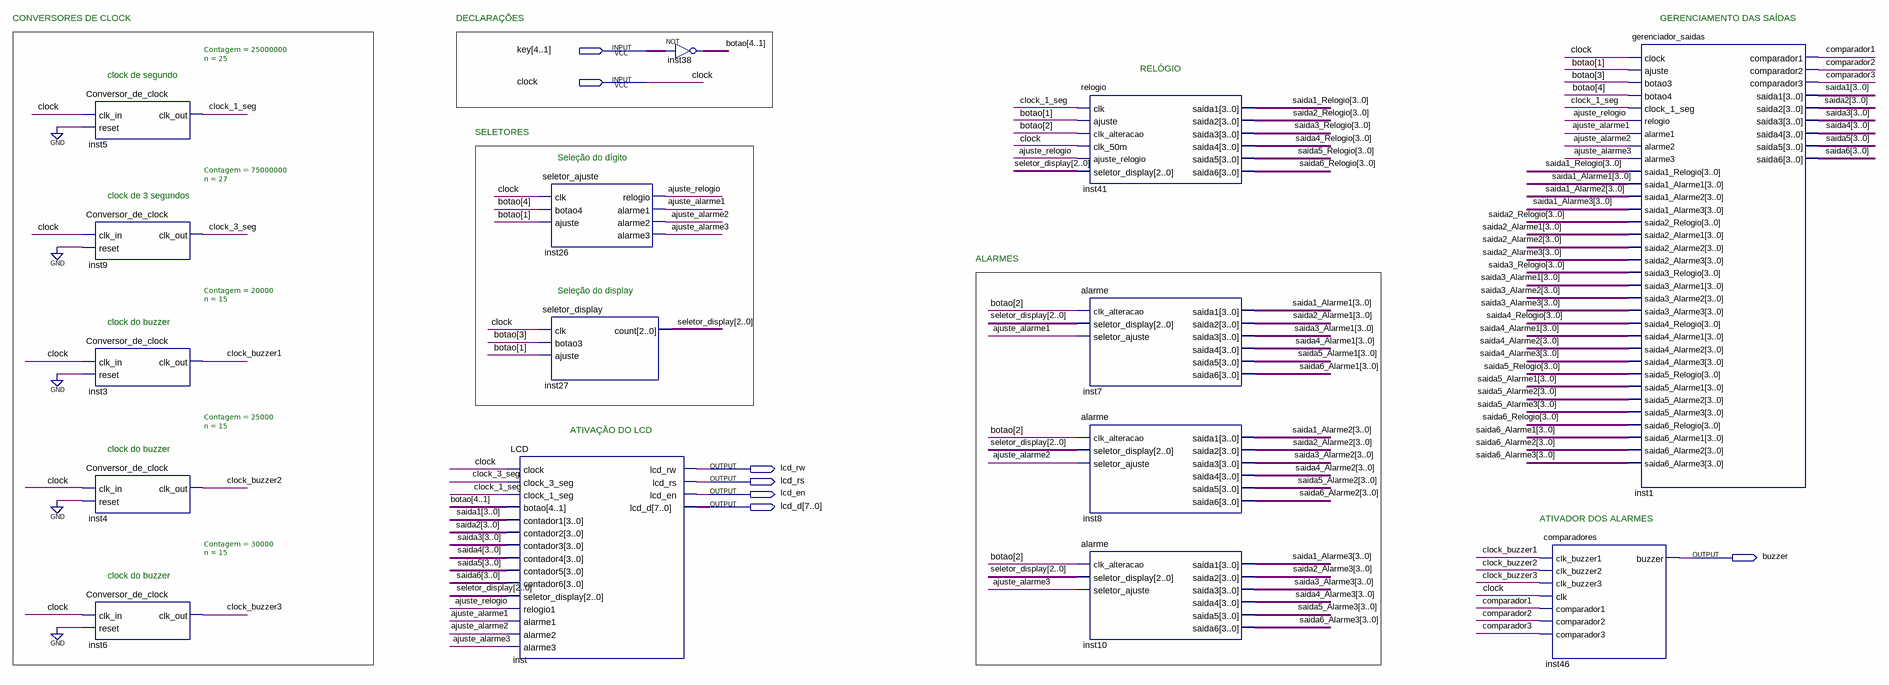
[diagram p0: schematic sheet]
// Quartus schematic principal.bdf as structural Verilog: 15 symbols, 7 pins
module principal (
  input  [4:1] key,
  input  clock,
  output lcd_rw,
  output lcd_rs,
  output lcd_en,
  output [7:0] lcd_d,
  output buzzer
);

  wire ajuste_alarme1, ajuste_alarme2, ajuste_alarme3, ajuste_relogio, clock_1_seg, clock_3_seg,
       clock_buzzer1, clock_buzzer2, clock_buzzer3, comparador1, comparador2, comparador3;
  wire [2:0] seletor_display;
  wire [3:0] saida1, saida1_Alarme1, saida1_Alarme2, saida1_Alarme3, saida1_Relogio, saida2, saida2_Alarme1,
       saida2_Alarme2, saida2_Alarme3, saida2_Relogio, saida3, saida3_Alarme1, saida3_Alarme2,
       saida3_Alarme3, saida3_Relogio, saida4, saida4_Alarme1, saida4_Alarme2, saida4_Alarme3,
       saida4_Relogio, saida5, saida5_Alarme1, saida5_Alarme2, saida5_Alarme3, saida5_Relogio, saida6,
       saida6_Alarme1, saida6_Alarme2, saida6_Alarme3, saida6_Relogio;
  wire [4:1] botao;

  Conversor_de_clock #(.Contagem(25000000), .n(25)) inst5 (.clk_in(clock), .reset(1'b0), .clk_out(clock_1_seg));
  Conversor_de_clock #(.Contagem(75000000), .n(27)) inst9 (.clk_in(clock), .reset(1'b0), .clk_out(clock_3_seg));
  Conversor_de_clock #(.Contagem(20000), .n(15)) inst3 (.clk_in(clock), .reset(1'b0), .clk_out(clock_buzzer1));
  Conversor_de_clock #(.Contagem(25000), .n(15)) inst4 (.clk_in(clock), .reset(1'b0), .clk_out(clock_buzzer2));
  Conversor_de_clock #(.Contagem(30000), .n(15)) inst6 (.clk_in(clock), .reset(1'b0), .clk_out(clock_buzzer3));
  LCD inst (
    .clock(clock), .clock_3_seg(clock_3_seg), .clock_1_seg(clock_1_seg), .botao(botao), .contador1(saida1),
    .contador2(saida2), .contador3(saida3), .contador4(saida4), .contador5(saida5), .contador6(saida6),
    .seletor_display(seletor_display), .relogio1(ajuste_relogio), .alarme1(ajuste_alarme1),
    .alarme2(ajuste_alarme2), .alarme3(ajuste_alarme3), .lcd_rw(lcd_rw), .lcd_rs(lcd_rs), .lcd_en(lcd_en),
    .lcd_d(lcd_d));
  seletor_ajuste inst26 (
    .clk(clock), .botao4(botao[4]), .ajuste(botao[1]), .relogio(ajuste_relogio), .alarme1(ajuste_alarme1),
    .alarme2(ajuste_alarme2), .alarme3(ajuste_alarme3));
  seletor_display inst27 (.clk(clock), .botao3(botao[3]), .ajuste(botao[1]), .count(seletor_display));
  assign botao = ~key;  // NOT inst38, 4 bits wide
  relogio inst41 (
    .clk(clock_1_seg), .ajuste(botao[1]), .clk_alteracao(botao[2]), .clk_50m(clock),
    .ajuste_relogio(ajuste_relogio), .seletor_display(seletor_display), .saida1(saida1_Relogio),
    .saida2(saida2_Relogio), .saida3(saida3_Relogio), .saida4(saida4_Relogio), .saida5(saida5_Relogio),
    .saida6(saida6_Relogio));
  alarme inst7 (
    .clk_alteracao(botao[2]), .seletor_display(seletor_display), .seletor_ajuste(ajuste_alarme1),
    .saida1(saida1_Alarme1), .saida2(saida2_Alarme1), .saida3(saida3_Alarme1), .saida4(saida4_Alarme1),
    .saida5(saida5_Alarme1), .saida6(saida6_Alarme1));
  alarme inst8 (
    .clk_alteracao(botao[2]), .seletor_display(seletor_display), .seletor_ajuste(ajuste_alarme2),
    .saida1(saida1_Alarme2), .saida2(saida2_Alarme2), .saida3(saida3_Alarme2), .saida4(saida4_Alarme2),
    .saida5(saida5_Alarme2), .saida6(saida6_Alarme2));
  alarme inst10 (
    .clk_alteracao(botao[2]), .seletor_display(seletor_display), .seletor_ajuste(ajuste_alarme3),
    .saida1(saida1_Alarme3), .saida2(saida2_Alarme3), .saida3(saida3_Alarme3), .saida4(saida4_Alarme3),
    .saida5(saida5_Alarme3), .saida6(saida6_Alarme3));
  comparadores inst46 (
    .clk_buzzer1(clock_buzzer1), .clk_buzzer2(clock_buzzer2), .clk_buzzer3(clock_buzzer3), .clk(clock),
    .comparador1(comparador1), .comparador2(comparador2), .comparador3(comparador3), .buzzer(buzzer));
  gerenciador_saidas inst1 (
    .clock(clock), .ajuste(botao[1]), .botao3(botao[3]), .botao4(botao[4]), .clock_1_seg(clock_1_seg),
    .relogio(ajuste_relogio), .alarme1(ajuste_alarme1), .alarme2(ajuste_alarme2), .alarme3(ajuste_alarme3),
    .saida1_Relogio(saida1_Relogio), .saida1_Alarme1(saida1_Alarme1), .saida1_Alarme2(saida1_Alarme2),
    .saida1_Alarme3(saida1_Alarme3), .saida2_Relogio(saida2_Relogio), .saida2_Alarme1(saida2_Alarme1),
    .saida2_Alarme2(saida2_Alarme2), .saida2_Alarme3(saida2_Alarme3), .saida3_Relogio(saida3_Relogio),
    .saida3_Alarme1(saida3_Alarme1), .saida3_Alarme2(saida3_Alarme2), .saida3_Alarme3(saida3_Alarme3),
    .saida4_Relogio(saida4_Relogio), .saida4_Alarme1(saida4_Alarme1), .saida4_Alarme2(saida4_Alarme2),
    .saida4_Alarme3(saida4_Alarme3), .saida5_Relogio(saida5_Relogio), .saida5_Alarme1(saida5_Alarme1),
    .saida5_Alarme2(saida5_Alarme2), .saida5_Alarme3(saida5_Alarme3), .saida6_Relogio(saida6_Relogio),
    .saida6_Alarme1(saida6_Alarme1), .saida6_Alarme2(saida6_Alarme2), .saida6_Alarme3(saida6_Alarme3),
    .comparador1(comparador1), .comparador2(comparador2), .comparador3(comparador3), .saida1(saida1),
    .saida2(saida2), .saida3(saida3), .saida4(saida4), .saida5(saida5), .saida6(saida6));

  // Notes on the sheet:
  //   CONVERSORES DE CLOCK
  //   DECLARAÇÕES
  //   GERENCIAMENTO DAS SAÍDAS
  //   RELÓGIO
  //   clock de segundo
  //   SELETORES
  //   Seleção do dígito
  //   clock de 3 segundos
  //   ALARMES
  //   Seleção do display
  //   clock do buzzer
  //   ATIVAÇÃO DO LCD
  //   clock do buzzer
  //   ATIVADOR DOS ALARMES
  //   clock do buzzer
endmodule
